# EAGLE schematic board (EAGLE 9.6.1)

## Sheet 1 of 3: key
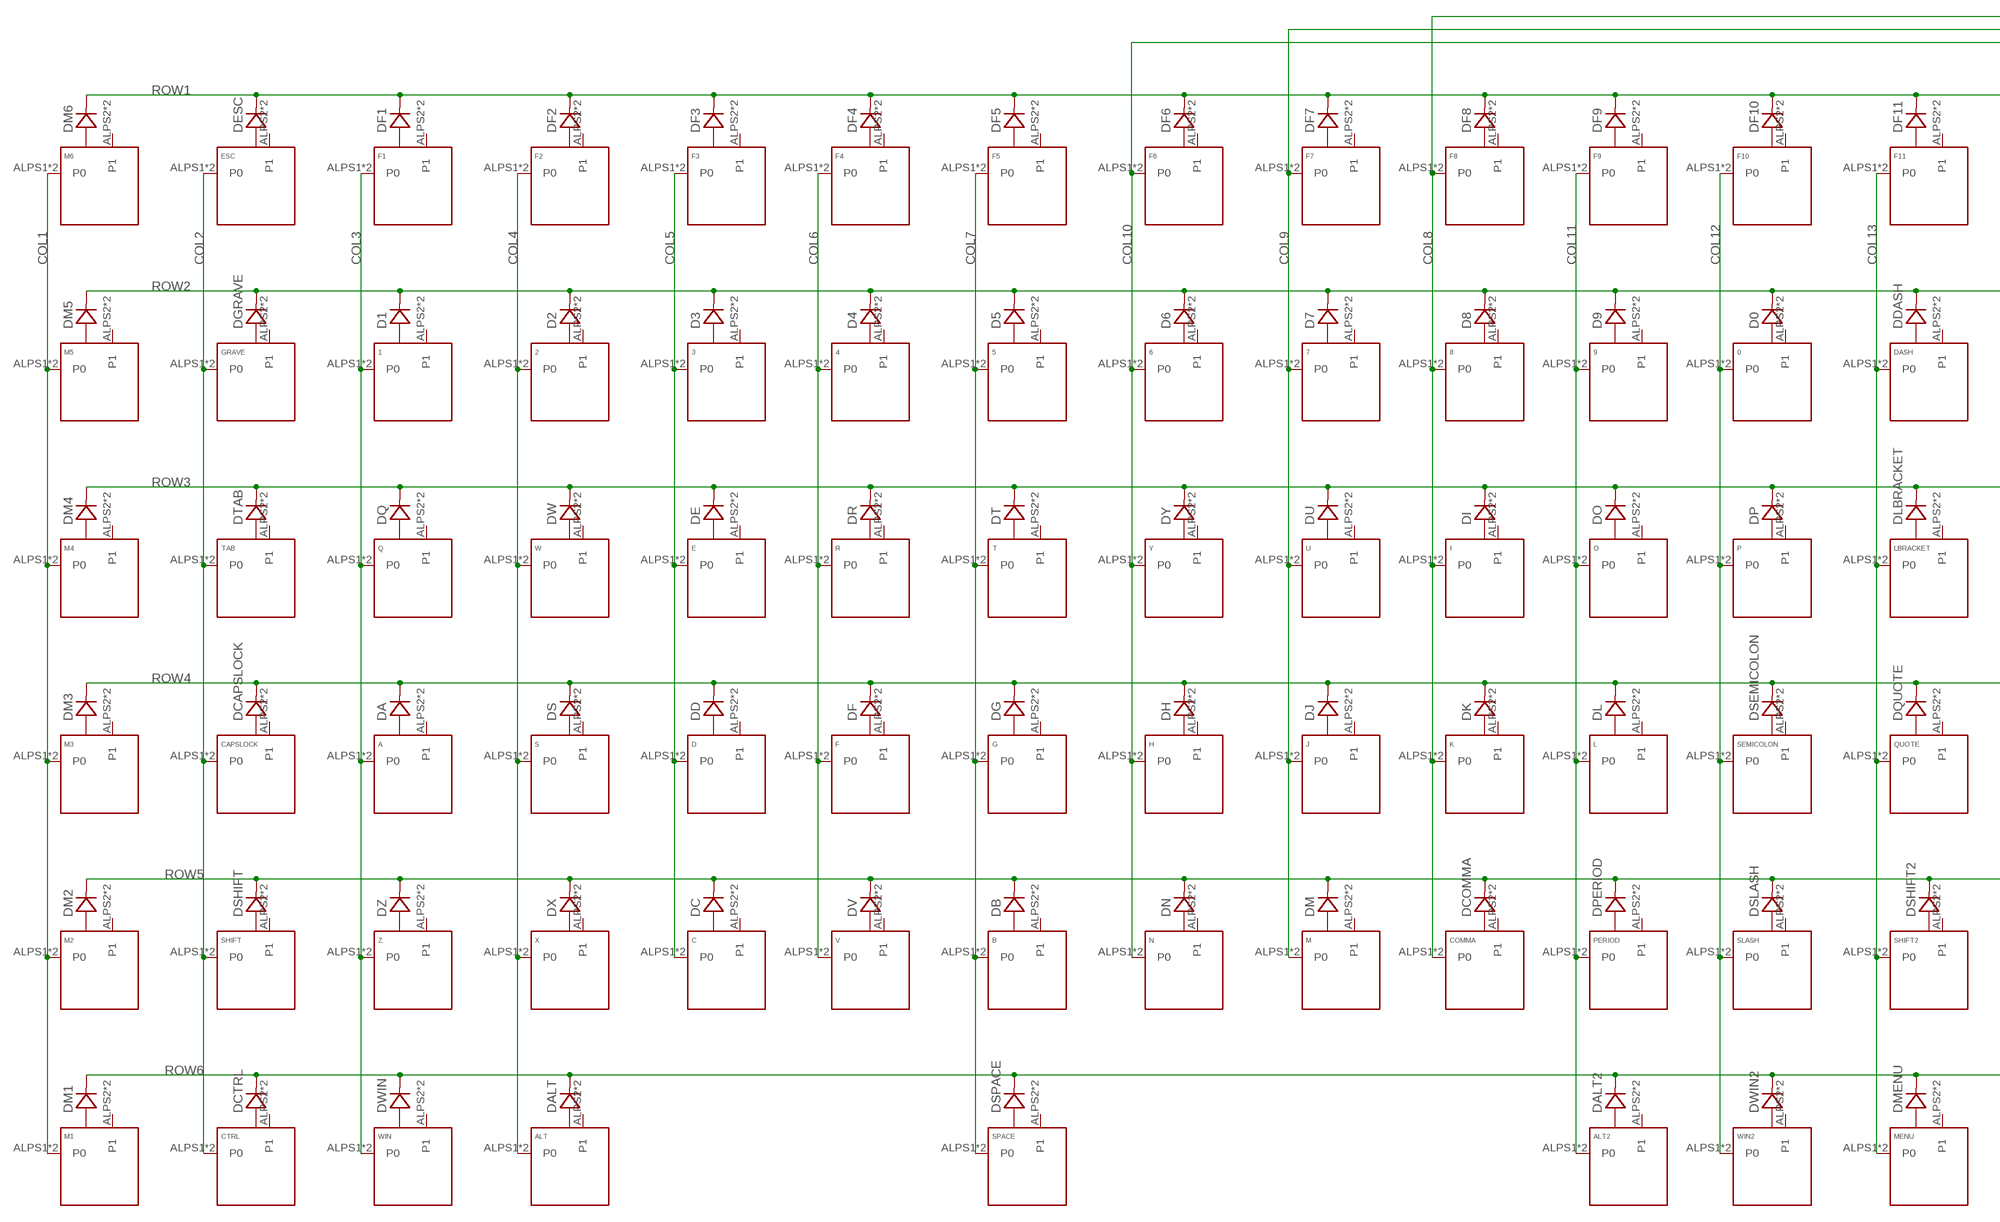
[diagram p0: schematic, sheet 1, part 1 of 2]
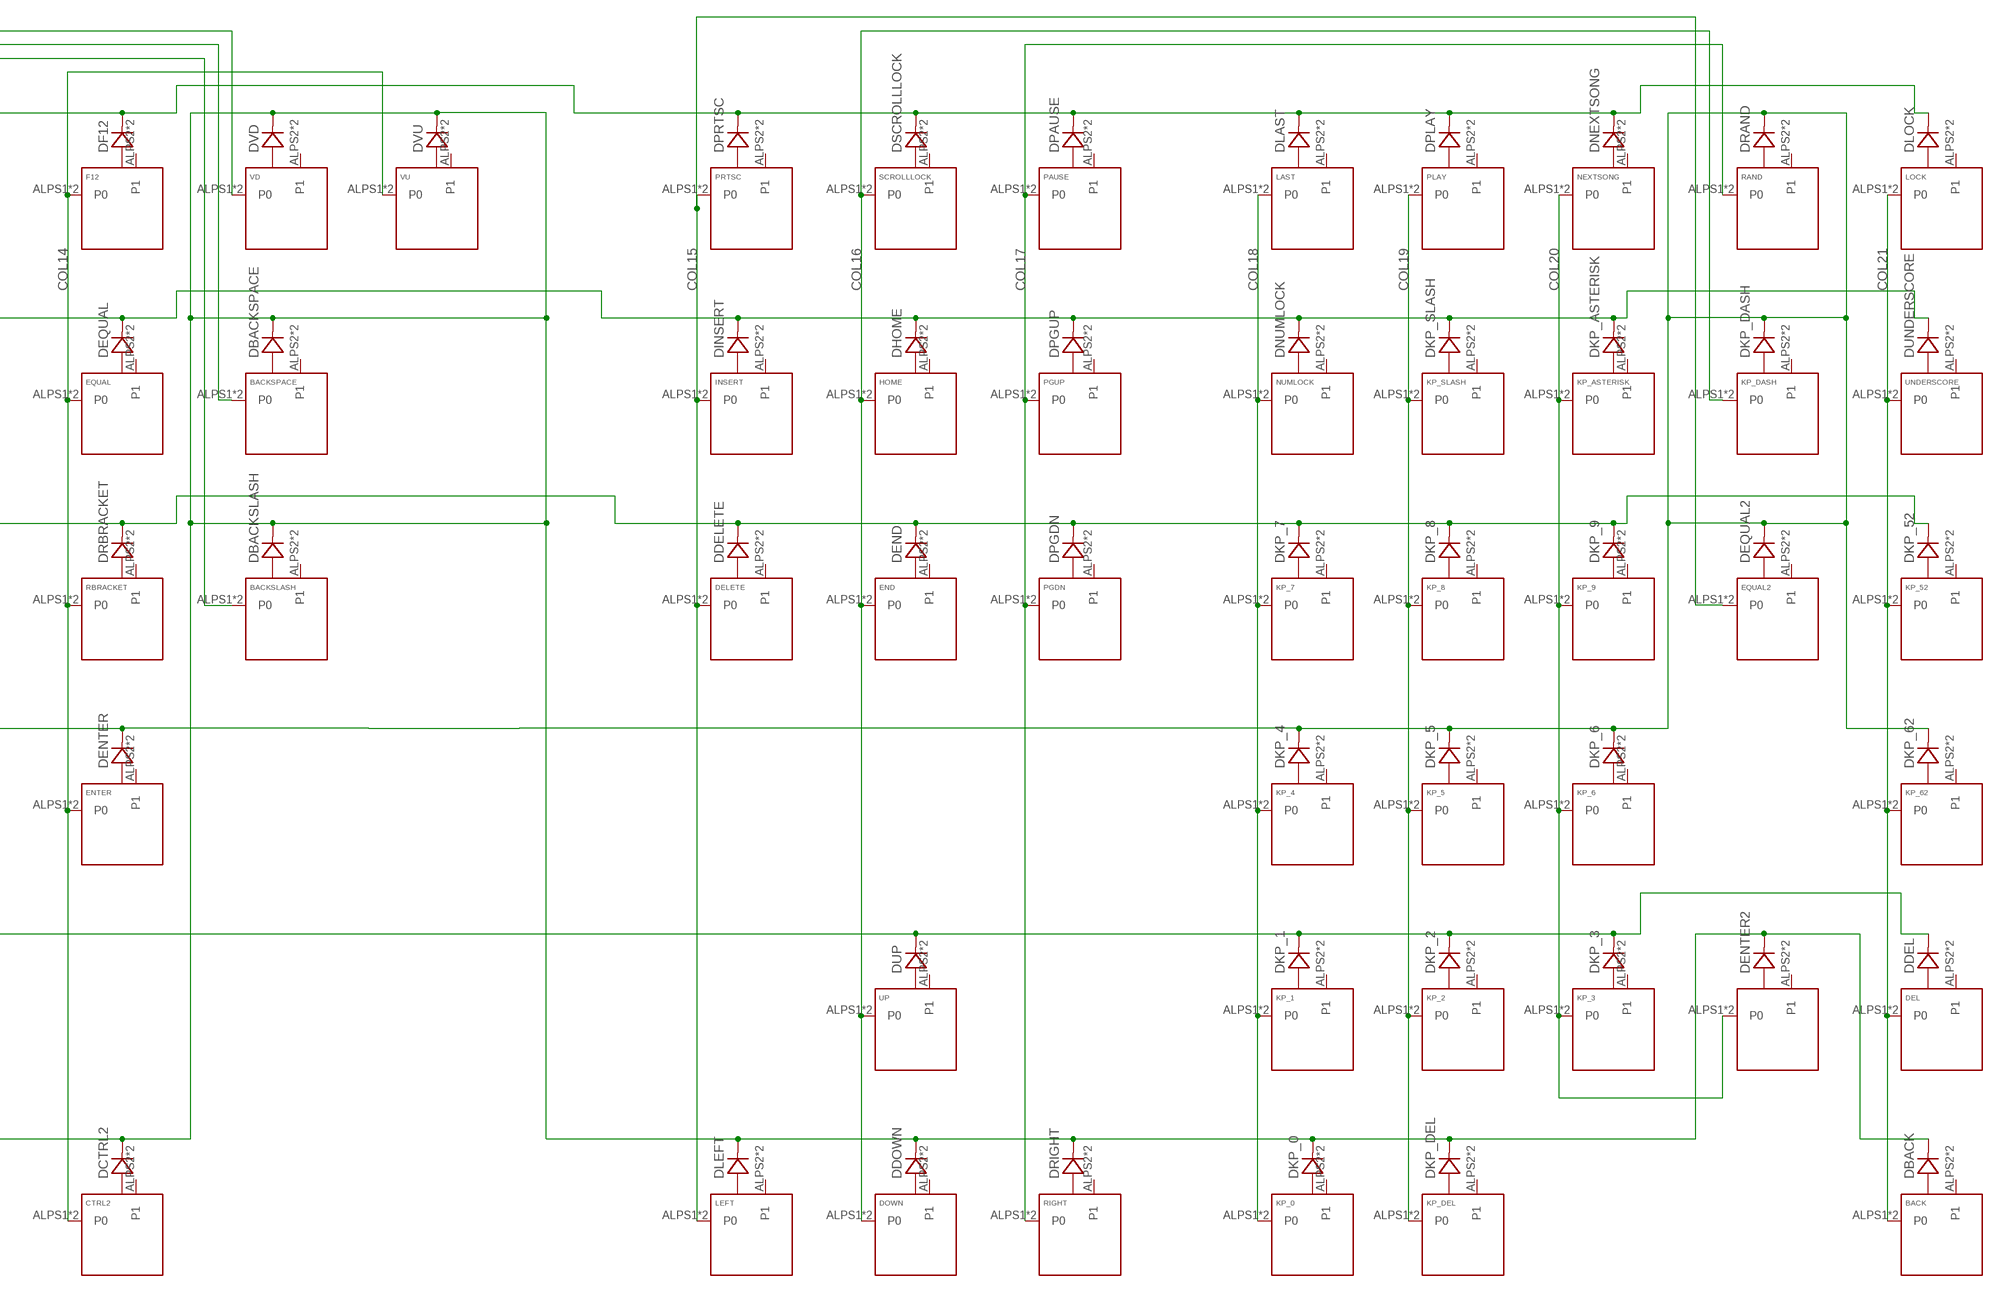
[diagram p1: schematic, sheet 1, part 2 of 2]

### Parts
0  KEYSWITCH-PLAIN-ALPSMX-1U  [ALPSMX-1U]
1  KEYSWITCH-PLAIN-ALPSMX-1U  [ALPSMX-1U]
2  KEYSWITCH-PLAIN-ALPSMX-1U  [ALPSMX-1U]
3  KEYSWITCH-PLAIN-ALPSMX-1U  [ALPSMX-1U]
4  KEYSWITCH-PLAIN-ALPSMX-1U  [ALPSMX-1U]
5  KEYSWITCH-PLAIN-ALPSMX-1U  [ALPSMX-1U]
6  KEYSWITCH-PLAIN-ALPSMX-1U  [ALPSMX-1U]
7  KEYSWITCH-PLAIN-ALPSMX-1U  [ALPSMX-1U]
8  KEYSWITCH-PLAIN-ALPSMX-1U  [ALPSMX-1U]
9  KEYSWITCH-PLAIN-ALPSMX-1U  [ALPSMX-1U]
A  KEYSWITCH-PLAIN-ALPSMX-1U  [ALPSMX-1U]
ALT  KEYSWITCH-PLAIN-ALPSMX-1U  [ALPSMX-1U]
ALT2  KEYSWITCH-PLAIN-ALPSMX-1U  [ALPSMX-1U]
B  KEYSWITCH-PLAIN-ALPSMX-1U  [ALPSMX-1U]
BACK  KEYSWITCH-PLAIN-ALPSMX-1U  [ALPSMX-1U]
BACKSLASH  KEYSWITCH-PLAIN-ALPSMX-1U  [ALPSMX-1U]
BACKSPACE  KEYSWITCH-PLAIN-ALPSMX-2U  [ALPSMX-2U]
C  KEYSWITCH-PLAIN-ALPSMX-1U  [ALPSMX-1U]
CAPSLOCK  KEYSWITCH-PLAIN-ALPSMX-1U  [ALPSMX-1U]
COMMA  KEYSWITCH-PLAIN-ALPSMX-1U  [ALPSMX-1U]
CTRL  KEYSWITCH-PLAIN-ALPSMX-1U  [ALPSMX-1U]
CTRL2  KEYSWITCH-PLAIN-ALPSMX-1U  [ALPSMX-1U]
D  KEYSWITCH-PLAIN-ALPSMX-1U  [ALPSMX-1U]
D0  DIODE-SOD-123  [SOD-123]
D1  DIODE-SOD-123  [SOD-123]
D2  DIODE-SOD-123  [SOD-123]
D3  DIODE-SOD-123  [SOD-123]
D4  DIODE-SOD-123  [SOD-123]
D5  DIODE-SOD-123  [SOD-123]
D6  DIODE-SOD-123  [SOD-123]
D7  DIODE-SOD-123  [SOD-123]
D8  DIODE-SOD-123  [SOD-123]
D9  DIODE-SOD-123  [SOD-123]
DA  DIODE-SOD-123  [SOD-123]
DALT  DIODE-SOD-123  [SOD-123]
DALT2  DIODE-SOD-123  [SOD-123]
DASH  KEYSWITCH-PLAIN-ALPSMX-1U  [ALPSMX-1U]
DB  DIODE-SOD-123  [SOD-123]
DBACK  DIODE-SOD-123  [SOD-123]
DBACKSLASH  DIODE-SOD-123  [SOD-123]
DBACKSPACE  DIODE-SOD-123  [SOD-123]
DC  DIODE-SOD-123  [SOD-123]
DCAPSLOCK  DIODE-SOD-123  [SOD-123]
DCOMMA  DIODE-SOD-123  [SOD-123]
DCTRL  DIODE-SOD-123  [SOD-123]
DCTRL2  DIODE-SOD-123  [SOD-123]
DD  DIODE-SOD-123  [SOD-123]
DDASH  DIODE-SOD-123  [SOD-123]
DDEL  DIODE-SOD-123  [SOD-123]
DDELETE  DIODE-SOD-123  [SOD-123]
DDOWN  DIODE-SOD-123  [SOD-123]
DE  DIODE-SOD-123  [SOD-123]
DEL  KEYSWITCH-PLAIN-ALPSMX-1U  [ALPSMX-1U]
DELETE  KEYSWITCH-PLAIN-ALPSMX-1U  [ALPSMX-1U]
DEND  DIODE-SOD-123  [SOD-123]
DENTER  DIODE-SOD-123  [SOD-123]
DENTER2  DIODE-SOD-123  [SOD-123]
DEQUAL  DIODE-SOD-123  [SOD-123]
DEQUAL2  DIODE-SOD-123  [SOD-123]
DESC  DIODE-SOD-123  [SOD-123]
DF  DIODE-SOD-123  [SOD-123]
DF1  DIODE-SOD-123  [SOD-123]
DF2  DIODE-SOD-123  [SOD-123]
DF3  DIODE-SOD-123  [SOD-123]
DF4  DIODE-SOD-123  [SOD-123]
DF5  DIODE-SOD-123  [SOD-123]
DF6  DIODE-SOD-123  [SOD-123]
DF7  DIODE-SOD-123  [SOD-123]
DF8  DIODE-SOD-123  [SOD-123]
DF9  DIODE-SOD-123  [SOD-123]
DF10  DIODE-SOD-123  [SOD-123]
DF11  DIODE-SOD-123  [SOD-123]
DF12  DIODE-SOD-123  [SOD-123]
DG  DIODE-SOD-123  [SOD-123]
DGRAVE  DIODE-SOD-123  [SOD-123]
DH  DIODE-SOD-123  [SOD-123]
DHOME  DIODE-SOD-123  [SOD-123]
DI  DIODE-SOD-123  [SOD-123]
DINSERT  DIODE-SOD-123  [SOD-123]
DJ  DIODE-SOD-123  [SOD-123]
DK  DIODE-SOD-123  [SOD-123]
DKP_0  DIODE-SOD-123  [SOD-123]
DKP_1  DIODE-SOD-123  [SOD-123]
DKP_2  DIODE-SOD-123  [SOD-123]
DKP_3  DIODE-SOD-123  [SOD-123]
DKP_4  DIODE-SOD-123  [SOD-123]
DKP_5  DIODE-SOD-123  [SOD-123]
DKP_6  DIODE-SOD-123  [SOD-123]
DKP_7  DIODE-SOD-123  [SOD-123]
DKP_8  DIODE-SOD-123  [SOD-123]
DKP_9  DIODE-SOD-123  [SOD-123]
DKP_52  DIODE-SOD-123  [SOD-123]
DKP_62  DIODE-SOD-123  [SOD-123]
DKP_ASTERISK  DIODE-SOD-123  [SOD-123]
DKP_DASH  DIODE-SOD-123  [SOD-123]
DKP_DEL  DIODE-SOD-123  [SOD-123]
DKP_SLASH  DIODE-SOD-123  [SOD-123]
DL  DIODE-SOD-123  [SOD-123]
DLAST  DIODE-SOD-123  [SOD-123]
DLBRACKET  DIODE-SOD-123  [SOD-123]
DLEFT  DIODE-SOD-123  [SOD-123]
DLOCK  DIODE-SOD-123  [SOD-123]
DM  DIODE-SOD-123  [SOD-123]
DM1  DIODE-SOD-123  [SOD-123]
DM2  DIODE-SOD-123  [SOD-123]
DM3  DIODE-SOD-123  [SOD-123]
DM4  DIODE-SOD-123  [SOD-123]
DM5  DIODE-SOD-123  [SOD-123]
DM6  DIODE-SOD-123  [SOD-123]
DMENU  DIODE-SOD-123  [SOD-123]
DN  DIODE-SOD-123  [SOD-123]
DNEXTSONG  DIODE-SOD-123  [SOD-123]
DNUMLOCK  DIODE-SOD-123  [SOD-123]
DO  DIODE-SOD-123  [SOD-123]
DOWN  KEYSWITCH-PLAIN-ALPSMX-1U  [ALPSMX-1U]
DP  DIODE-SOD-123  [SOD-123]
DPAUSE  DIODE-SOD-123  [SOD-123]
DPERIOD  DIODE-SOD-123  [SOD-123]
DPGDN  DIODE-SOD-123  [SOD-123]
DPGUP  DIODE-SOD-123  [SOD-123]
DPLAY  DIODE-SOD-123  [SOD-123]
DPRTSC  DIODE-SOD-123  [SOD-123]
DQ  DIODE-SOD-123  [SOD-123]
DQUOTE  DIODE-SOD-123  [SOD-123]
DR  DIODE-SOD-123  [SOD-123]
DRAND  DIODE-SOD-123  [SOD-123]
DRBRACKET  DIODE-SOD-123  [SOD-123]
DRIGHT  DIODE-SOD-123  [SOD-123]
DS  DIODE-SOD-123  [SOD-123]
DSCROLLLOCK  DIODE-SOD-123  [SOD-123]
DSEMICOLON  DIODE-SOD-123  [SOD-123]
DSHIFT  DIODE-SOD-123  [SOD-123]
DSHIFT2  DIODE-SOD-123  [SOD-123]
DSLASH  DIODE-SOD-123  [SOD-123]
DSPACE  DIODE-SOD-123  [SOD-123]
DT  DIODE-SOD-123  [SOD-123]
DTAB  DIODE-SOD-123  [SOD-123]
DU  DIODE-SOD-123  [SOD-123]
DUNDERSCORE  DIODE-SOD-123  [SOD-123]
DUP  DIODE-SOD-123  [SOD-123]
DV  DIODE-SOD-123  [SOD-123]
DVD  DIODE-SOD-123  [SOD-123]
DVU  DIODE-SOD-123  [SOD-123]
DW  DIODE-SOD-123  [SOD-123]
DWIN  DIODE-SOD-123  [SOD-123]
DWIN2  DIODE-SOD-123  [SOD-123]
DX  DIODE-SOD-123  [SOD-123]
DY  DIODE-SOD-123  [SOD-123]
DZ  DIODE-SOD-123  [SOD-123]
E  KEYSWITCH-PLAIN-ALPSMX-1U  [ALPSMX-1U]
END  KEYSWITCH-PLAIN-ALPSMX-1U  [ALPSMX-1U]
ENTER  KEYSWITCH-PLAIN-ALPSMX-2U  [ALPSMX-2U]
ENTER2  KEYSWITCH-PLAIN-ALPSMX-1U  [ALPSMX-1U]
EQUAL  KEYSWITCH-PLAIN-ALPSMX-1U  [ALPSMX-1U]
EQUAL2  KEYSWITCH-PLAIN-ALPSMX-1U  [ALPSMX-1U]
ESC  KEYSWITCH-PLAIN-ALPSMX-1U  [ALPSMX-1U]
F  KEYSWITCH-PLAIN-ALPSMX-1U  [ALPSMX-1U]
F1  KEYSWITCH-PLAIN-ALPSMX-1U  [ALPSMX-1U]
F2  KEYSWITCH-PLAIN-ALPSMX-1U  [ALPSMX-1U]
F3  KEYSWITCH-PLAIN-ALPSMX-1U  [ALPSMX-1U]
F4  KEYSWITCH-PLAIN-ALPSMX-1U  [ALPSMX-1U]
F5  KEYSWITCH-PLAIN-ALPSMX-1U  [ALPSMX-1U]
F6  KEYSWITCH-PLAIN-ALPSMX-1U  [ALPSMX-1U]
F7  KEYSWITCH-PLAIN-ALPSMX-1U  [ALPSMX-1U]
F8  KEYSWITCH-PLAIN-ALPSMX-1U  [ALPSMX-1U]
F9  KEYSWITCH-PLAIN-ALPSMX-1U  [ALPSMX-1U]
F10  KEYSWITCH-PLAIN-ALPSMX-1U  [ALPSMX-1U]
F11  KEYSWITCH-PLAIN-ALPSMX-1U  [ALPSMX-1U]
F12  KEYSWITCH-PLAIN-ALPSMX-1U  [ALPSMX-1U]
G  KEYSWITCH-PLAIN-ALPSMX-1U  [ALPSMX-1U]
GRAVE  KEYSWITCH-PLAIN-ALPSMX-1U  [ALPSMX-1U]
H  KEYSWITCH-PLAIN-ALPSMX-1U  [ALPSMX-1U]
HOME  KEYSWITCH-PLAIN-ALPSMX-1U  [ALPSMX-1U]
I  KEYSWITCH-PLAIN-ALPSMX-1U  [ALPSMX-1U]
INSERT  KEYSWITCH-PLAIN-ALPSMX-1U  [ALPSMX-1U]
J  KEYSWITCH-PLAIN-ALPSMX-1U  [ALPSMX-1U]
K  KEYSWITCH-PLAIN-ALPSMX-1U  [ALPSMX-1U]
KP_0  KEYSWITCH-PLAIN-ALPSMX-2U  [ALPSMX-2U]
KP_1  KEYSWITCH-PLAIN-ALPSMX-1U  [ALPSMX-1U]
KP_2  KEYSWITCH-PLAIN-ALPSMX-1U  [ALPSMX-1U]
KP_3  KEYSWITCH-PLAIN-ALPSMX-1U  [ALPSMX-1U]
KP_4  KEYSWITCH-PLAIN-ALPSMX-1U  [ALPSMX-1U]
KP_5  KEYSWITCH-PLAIN-ALPSMX-1U  [ALPSMX-1U]
KP_6  KEYSWITCH-PLAIN-ALPSMX-1U  [ALPSMX-1U]
KP_7  KEYSWITCH-PLAIN-ALPSMX-1U  [ALPSMX-1U]
KP_8  KEYSWITCH-PLAIN-ALPSMX-1U  [ALPSMX-1U]
KP_9  KEYSWITCH-PLAIN-ALPSMX-1U  [ALPSMX-1U]
KP_52  KEYSWITCH-PLAIN-ALPSMX-1U  [ALPSMX-1U]
KP_62  KEYSWITCH-PLAIN-ALPSMX-1U  [ALPSMX-1U]
KP_ASTERISK  KEYSWITCH-PLAIN-ALPSMX-1U  [ALPSMX-1U]
KP_DASH  KEYSWITCH-PLAIN-ALPSMX-1U  [ALPSMX-1U]
KP_DEL  KEYSWITCH-PLAIN-ALPSMX-1U  [ALPSMX-1U]
KP_SLASH  KEYSWITCH-PLAIN-ALPSMX-1U  [ALPSMX-1U]
L  KEYSWITCH-PLAIN-ALPSMX-1U  [ALPSMX-1U]
LAST  KEYSWITCH-PLAIN-ALPSMX-1U  [ALPSMX-1U]
LBRACKET  KEYSWITCH-PLAIN-ALPSMX-1U  [ALPSMX-1U]
LEFT  KEYSWITCH-PLAIN-ALPSMX-1U  [ALPSMX-1U]
LOCK  KEYSWITCH-PLAIN-ALPSMX-1U  [ALPSMX-1U]
M  KEYSWITCH-PLAIN-ALPSMX-1U  [ALPSMX-1U]
M1  KEYSWITCH-PLAIN-ALPSMX-1U  [ALPSMX-1U]
M2  KEYSWITCH-PLAIN-ALPSMX-1U  [ALPSMX-1U]
M3  KEYSWITCH-PLAIN-ALPSMX-1U  [ALPSMX-1U]
M4  KEYSWITCH-PLAIN-ALPSMX-1U  [ALPSMX-1U]
M5  KEYSWITCH-PLAIN-ALPSMX-1U  [ALPSMX-1U]
M6  KEYSWITCH-PLAIN-ALPSMX-1U  [ALPSMX-1U]
MENU  KEYSWITCH-PLAIN-ALPSMX-1U  [ALPSMX-1U]
N  KEYSWITCH-PLAIN-ALPSMX-1U  [ALPSMX-1U]
NEXTSONG  KEYSWITCH-PLAIN-ALPSMX-1U  [ALPSMX-1U]
NUMLOCK  KEYSWITCH-PLAIN-ALPSMX-1U  [ALPSMX-1U]
O  KEYSWITCH-PLAIN-ALPSMX-1U  [ALPSMX-1U]
P  KEYSWITCH-PLAIN-ALPSMX-1U  [ALPSMX-1U]
PAUSE  KEYSWITCH-PLAIN-ALPSMX-1U  [ALPSMX-1U]
PERIOD  KEYSWITCH-PLAIN-ALPSMX-1U  [ALPSMX-1U]
PGDN  KEYSWITCH-PLAIN-ALPSMX-1U  [ALPSMX-1U]
PGUP  KEYSWITCH-PLAIN-ALPSMX-1U  [ALPSMX-1U]
PLAY  KEYSWITCH-PLAIN-ALPSMX-1U  [ALPSMX-1U]
PRTSC  KEYSWITCH-PLAIN-ALPSMX-1U  [ALPSMX-1U]
Q  KEYSWITCH-PLAIN-ALPSMX-1U  [ALPSMX-1U]
QUOTE  KEYSWITCH-PLAIN-ALPSMX-1U  [ALPSMX-1U]
R  KEYSWITCH-PLAIN-ALPSMX-1U  [ALPSMX-1U]
RAND  KEYSWITCH-PLAIN-ALPSMX-1U  [ALPSMX-1U]
RBRACKET  KEYSWITCH-PLAIN-ALPSMX-1U  [ALPSMX-1U]
RIGHT  KEYSWITCH-PLAIN-ALPSMX-1U  [ALPSMX-1U]
S  KEYSWITCH-PLAIN-ALPSMX-1U  [ALPSMX-1U]
SCROLLLOCK  KEYSWITCH-PLAIN-ALPSMX-1U  [ALPSMX-1U]
SEMICOLON  KEYSWITCH-PLAIN-ALPSMX-1U  [ALPSMX-1U]
SHIFT  KEYSWITCH-PLAIN-ALPSMX-2U  [ALPSMX-2U]
SHIFT2  KEYSWITCH-PLAIN-ALPSMX-2U  [ALPSMX-2U]
SLASH  KEYSWITCH-PLAIN-ALPSMX-1U  [ALPSMX-1U]
SPACE  KEYSWITCH-PLAIN-ALPSMX-6.25U  [ALPSMX-6.25U]
T  KEYSWITCH-PLAIN-ALPSMX-1U  [ALPSMX-1U]
TAB  KEYSWITCH-PLAIN-ALPSMX-1U  [ALPSMX-1U]
U  KEYSWITCH-PLAIN-ALPSMX-1U  [ALPSMX-1U]
UNDERSCORE  KEYSWITCH-PLAIN-ALPSMX-1U  [ALPSMX-1U]
UP  KEYSWITCH-PLAIN-ALPSMX-1U  [ALPSMX-1U]
V  KEYSWITCH-PLAIN-ALPSMX-1U  [ALPSMX-1U]
VD  KEYSWITCH-PLAIN-ALPSMX-1U  [ALPSMX-1U]
VU  KEYSWITCH-PLAIN-ALPSMX-1U  [ALPSMX-1U]
W  KEYSWITCH-PLAIN-ALPSMX-1U  [ALPSMX-1U]
WIN  KEYSWITCH-PLAIN-ALPSMX-1U  [ALPSMX-1U]
WIN2  KEYSWITCH-PLAIN-ALPSMX-1U  [ALPSMX-1U]
X  KEYSWITCH-PLAIN-ALPSMX-1U  [ALPSMX-1U]
Y  KEYSWITCH-PLAIN-ALPSMX-1U  [ALPSMX-1U]
Z  KEYSWITCH-PLAIN-ALPSMX-1U  [ALPSMX-1U]

### Nets
COL1: M1.ALPS1(P0) M1.MX1(P0) M2.ALPS1(P0) M2.MX1(P0) M3.ALPS1(P0) M3.MX1(P0) M4.ALPS1(P0) M4.MX1(P0) M5.ALPS1(P0) M5.MX1(P0) M6.ALPS1(P0) M6.MX1(P0) ; also sheet 3
COL2: CAPSLOCK.ALPS1(P0) CAPSLOCK.MX1(P0) CTRL.ALPS1(P0) CTRL.MX1(P0) ESC.ALPS1(P0) ESC.MX1(P0) GRAVE.ALPS1(P0) GRAVE.MX1(P0) SHIFT.ALPS1(P0) SHIFT.MX1(P0) TAB.ALPS1(P0) TAB.MX1(P0) ; also sheet 3
COL3: 1.ALPS1(P0) 1.MX1(P0) A.ALPS1(P0) A.MX1(P0) F1.ALPS1(P0) F1.MX1(P0) Q.ALPS1(P0) Q.MX1(P0) WIN.ALPS1(P0) WIN.MX1(P0) Z.ALPS1(P0) Z.MX1(P0) ; also sheet 3
COL4: 2.ALPS1(P0) 2.MX1(P0) ALT.ALPS1(P0) ALT.MX1(P0) F2.ALPS1(P0) F2.MX1(P0) S.ALPS1(P0) S.MX1(P0) W.ALPS1(P0) W.MX1(P0) X.ALPS1(P0) X.MX1(P0) ; also sheet 3
COL5: 3.ALPS1(P0) 3.MX1(P0) C.ALPS1(P0) C.MX1(P0) D.ALPS1(P0) D.MX1(P0) E.ALPS1(P0) E.MX1(P0) F3.ALPS1(P0) F3.MX1(P0) ; also sheet 3
COL6: 4.ALPS1(P0) 4.MX1(P0) F4.ALPS1(P0) F4.MX1(P0) F.ALPS1(P0) F.MX1(P0) R.ALPS1(P0) R.MX1(P0) V.ALPS1(P0) V.MX1(P0) ; also sheet 3
COL7: 5.ALPS1(P0) 5.MX1(P0) B.ALPS1(P0) B.MX1(P0) F5.ALPS1(P0) F5.MX1(P0) G.ALPS1(P0) G.MX1(P0) SPACE.ALPS1(P0) SPACE.MX1(P0) T.ALPS1(P0) T.MX1(P0) ; also sheet 3
COL8: 8.ALPS1(P0) 8.MX1(P0) COMMA.ALPS1(P0) COMMA.MX1(P0) F8.ALPS1(P0) F8.MX1(P0) I.ALPS1(P0) I.MX1(P0) K.ALPS1(P0) K.MX1(P0) VD.ALPS1(P0) VD.MX1(P0) ; also sheet 3
COL9: 7.ALPS1(P0) 7.MX1(P0) BACKSPACE.ALPS1(P0) BACKSPACE.MX1(P0) F7.ALPS1(P0) F7.MX1(P0) J.ALPS1(P0) J.MX1(P0) M.ALPS1(P0) M.MX1(P0) U.ALPS1(P0) U.MX1(P0) ; also sheet 3
COL10: 6.ALPS1(P0) 6.MX1(P0) BACKSLASH.ALPS1(P0) BACKSLASH.MX1(P0) F6.ALPS1(P0) F6.MX1(P0) H.ALPS1(P0) H.MX1(P0) N.ALPS1(P0) N.MX1(P0) Y.ALPS1(P0) Y.MX1(P0) ; also sheet 3
COL11: 9.ALPS1(P0) 9.MX1(P0) ALT2.ALPS1(P0) ALT2.MX1(P0) F9.ALPS1(P0) F9.MX1(P0) L.ALPS1(P0) L.MX1(P0) O.ALPS1(P0) O.MX1(P0) PERIOD.ALPS1(P0) PERIOD.MX1(P0) ; also sheet 3
COL12: 0.ALPS1(P0) 0.MX1(P0) F10.ALPS1(P0) F10.MX1(P0) P.ALPS1(P0) P.MX1(P0) SEMICOLON.ALPS1(P0) SEMICOLON.MX1(P0) SLASH.ALPS1(P0) SLASH.MX1(P0) WIN2.ALPS1(P0) WIN2.MX1(P0) ; also sheet 3
COL13: DASH.ALPS1(P0) DASH.MX1(P0) F11.ALPS1(P0) F11.MX1(P0) LBRACKET.ALPS1(P0) LBRACKET.MX1(P0) MENU.ALPS1(P0) MENU.MX1(P0) QUOTE.ALPS1(P0) QUOTE.MX1(P0) SHIFT2.ALPS1(P0) SHIFT2.MX1(P0) ; also sheet 3
COL14: CTRL2.ALPS1(P0) CTRL2.MX1(P0) ENTER.ALPS1(P0) ENTER.MX1(P0) EQUAL.ALPS1(P0) EQUAL.MX1(P0) F12.ALPS1(P0) F12.MX1(P0) RBRACKET.ALPS1(P0) RBRACKET.MX1(P0) VU.ALPS1(P0) VU.MX1(P0) ; also sheet 3
COL15: DELETE.ALPS1(P0) DELETE.MX1(P0) EQUAL2.ALPS1(P0) EQUAL2.MX1(P0) INSERT.ALPS1(P0) INSERT.MX1(P0) LEFT.ALPS1(P0) LEFT.MX1(P0) PRTSC.ALPS1(P0) PRTSC.MX1(P0) ; also sheet 3
COL16: DOWN.ALPS1(P0) DOWN.MX1(P0) END.ALPS1(P0) END.MX1(P0) HOME.ALPS1(P0) HOME.MX1(P0) KP_DASH.ALPS1(P0) KP_DASH.MX1(P0) SCROLLLOCK.ALPS1(P0) SCROLLLOCK.MX1(P0) UP.ALPS1(P0) UP.MX1(P0) ; also sheet 3
COL17: PAUSE.ALPS1(P0) PAUSE.MX1(P0) PGDN.ALPS1(P0) PGDN.MX1(P0) PGUP.ALPS1(P0) PGUP.MX1(P0) RAND.ALPS1(P0) RAND.MX1(P0) RIGHT.ALPS1(P0) RIGHT.MX1(P0) ; also sheet 3
COL18: KP_0.ALPS1(P0) KP_0.MX1(P0) KP_1.ALPS1(P0) KP_1.MX1(P0) KP_4.ALPS1(P0) KP_4.MX1(P0) KP_7.ALPS1(P0) KP_7.MX1(P0) LAST.ALPS1(P0) LAST.MX1(P0) NUMLOCK.ALPS1(P0) NUMLOCK.MX1(P0) ; also sheet 3
COL19: KP_2.ALPS1(P0) KP_2.MX1(P0) KP_5.ALPS1(P0) KP_5.MX1(P0) KP_8.ALPS1(P0) KP_8.MX1(P0) KP_DEL.ALPS1(P0) KP_DEL.MX1(P0) KP_SLASH.ALPS1(P0) KP_SLASH.MX1(P0) PLAY.ALPS1(P0) PLAY.MX1(P0) ; also sheet 3
COL20: ENTER2.ALPS1(P0) ENTER2.MX1(P0) KP_3.ALPS1(P0) KP_3.MX1(P0) KP_6.ALPS1(P0) KP_6.MX1(P0) KP_9.ALPS1(P0) KP_9.MX1(P0) KP_ASTERISK.ALPS1(P0) KP_ASTERISK.MX1(P0) NEXTSONG.ALPS1(P0) NEXTSONG.MX1(P0) ; also sheet 3
COL21: BACK.ALPS1(P0) BACK.MX1(P0) DEL.ALPS1(P0) DEL.MX1(P0) KP_52.ALPS1(P0) KP_52.MX1(P0) KP_62.ALPS1(P0) KP_62.MX1(P0) LOCK.ALPS1(P0) LOCK.MX1(P0) UNDERSCORE.ALPS1(P0) UNDERSCORE.MX1(P0) ; also sheet 3
ROW1: DESC.C DF1.C DF2.C DF3.C DF4.C DF5.C DF6.C DF7.C DF8.C DF9.C DF10.C DF11.C DF12.C DLAST.C DLOCK.C DM6.C DNEXTSONG.C DPAUSE.C DPLAY.C DPRTSC.C DSCROLLLOCK.C ; also sheet 3
ROW2: D0.C D1.C D2.C D3.C D4.C D5.C D6.C D7.C D8.C D9.C DDASH.C DEQUAL.C DGRAVE.C DHOME.C DINSERT.C DKP_ASTERISK.C DKP_SLASH.C DM5.C DNUMLOCK.C DPGUP.C DUNDERSCORE.C ; also sheet 3
ROW3: DDELETE.C DE.C DEND.C DI.C DKP_7.C DKP_8.C DKP_9.C DKP_52.C DLBRACKET.C DM4.C DO.C DP.C DPGDN.C DQ.C DR.C DRBRACKET.C DT.C DTAB.C DU.C DW.C DY.C ; also sheet 3
ROW4: DA.C DCAPSLOCK.C DD.C DENTER.C DEQUAL2.C DF.C DG.C DH.C DJ.C DK.C DKP_4.C DKP_5.C DKP_6.C DKP_62.C DKP_DASH.C DL.C DM3.C DQUOTE.C DRAND.C DS.C DSEMICOLON.C ; also sheet 3
ROW5: DB.C DC.C DCOMMA.C DDEL.C DKP_1.C DKP_2.C DKP_3.C DM2.C DM.C DN.C DPERIOD.C DSHIFT2.C DSHIFT.C DSLASH.C DUP.C DV.C DX.C DZ.C ; also sheet 3
ROW6: DALT2.C DALT.C DBACK.C DBACKSLASH.C DBACKSPACE.C DCTRL2.C DCTRL.C DDOWN.C DENTER2.C DKP_0.C DKP_DEL.C DLEFT.C DM1.C DMENU.C DRIGHT.C DSPACE.C DVD.C DVU.C DWIN2.C DWIN.C ; also sheet 3
Unconnected: 0.ALPS2(P1) 0.MX2(P1) 1.ALPS2(P1) 1.MX2(P1) 2.ALPS2(P1) 2.MX2(P1) 3.ALPS2(P1) 3.MX2(P1) 4.ALPS2(P1) 4.MX2(P1) 5.ALPS2(P1) 5.MX2(P1) 6.ALPS2(P1) 6.MX2(P1) 7.ALPS2(P1) 7.MX2(P1) 8.ALPS2(P1) 8.MX2(P1) 9.ALPS2(P1) 9.MX2(P1) A.ALPS2(P1) A.MX2(P1) ALT2.ALPS2(P1) ALT2.MX2(P1) ALT.ALPS2(P1) ALT.MX2(P1) B.ALPS2(P1) B.MX2(P1) BACK.ALPS2(P1) BACK.MX2(P1) BACKSLASH.ALPS2(P1) BACKSLASH.MX2(P1) BACKSPACE.ALPS2(P1) BACKSPACE.MX2(P1) C.ALPS2(P1) C.MX2(P1) CAPSLOCK.ALPS2(P1) CAPSLOCK.MX2(P1) COMMA.ALPS2(P1) COMMA.MX2(P1) CTRL2.ALPS2(P1) CTRL2.MX2(P1) CTRL.ALPS2(P1) CTRL.MX2(P1) D0.A D1.A D2.A D3.A D4.A D5.A D6.A D7.A D8.A D9.A D.ALPS2(P1) D.MX2(P1) DA.A DALT2.A DALT.A DASH.ALPS2(P1) DASH.MX2(P1) DB.A DBACK.A DBACKSLASH.A DBACKSPACE.A DC.A DCAPSLOCK.A DCOMMA.A DCTRL2.A DCTRL.A DD.A DDASH.A DDEL.A DDELETE.A DDOWN.A DE.A DEL.ALPS2(P1) DEL.MX2(P1) DELETE.ALPS2(P1) DELETE.MX2(P1) DEND.A DENTER2.A DENTER.A DEQUAL2.A DEQUAL.A DESC.A DF1.A DF2.A DF3.A DF4.A DF5.A DF6.A DF7.A DF8.A DF9.A DF10.A DF11.A DF12.A DF.A DG.A DGRAVE.A DH.A DHOME.A DI.A DINSERT.A DJ.A DK.A DKP_0.A DKP_1.A DKP_2.A DKP_3.A DKP_4.A DKP_5.A DKP_6.A DKP_7.A DKP_8.A DKP_9.A DKP_52.A DKP_62.A DKP_ASTERISK.A DKP_DASH.A DKP_DEL.A DKP_SLASH.A DL.A DLAST.A DLBRACKET.A DLEFT.A DLOCK.A DM1.A DM2.A DM3.A DM4.A DM5.A DM6.A DM.A DMENU.A DN.A DNEXTSONG.A DNUMLOCK.A DO.A DOWN.ALPS2(P1) DOWN.MX2(P1) DP.A DPAUSE.A DPERIOD.A DPGDN.A DPGUP.A DPLAY.A DPRTSC.A DQ.A DQUOTE.A DR.A DRAND.A DRBRACKET.A DRIGHT.A DS.A DSCROLLLOCK.A DSEMICOLON.A DSHIFT2.A DSHIFT.A DSLASH.A DSPACE.A DT.A DTAB.A DU.A DUNDERSCORE.A DUP.A DV.A DVD.A DVU.A DW.A DWIN2.A DWIN.A DX.A DY.A DZ.A E.ALPS2(P1) E.MX2(P1) END.ALPS2(P1) END.MX2(P1) ENTER2.ALPS2(P1) ENTER2.MX2(P1) ENTER.ALPS2(P1) ENTER.MX2(P1) EQUAL2.ALPS2(P1) EQUAL2.MX2(P1) EQUAL.ALPS2(P1) EQUAL.MX2(P1) ESC.ALPS2(P1) ESC.MX2(P1) F1.ALPS2(P1) F1.MX2(P1) F2.ALPS2(P1) F2.MX2(P1) F3.ALPS2(P1) F3.MX2(P1) F4.ALPS2(P1) F4.MX2(P1) F5.ALPS2(P1) F5.MX2(P1) F6.ALPS2(P1) F6.MX2(P1) F7.ALPS2(P1) F7.MX2(P1) F8.ALPS2(P1) F8.MX2(P1) F9.ALPS2(P1) F9.MX2(P1) F10.ALPS2(P1) F10.MX2(P1) F11.ALPS2(P1) F11.MX2(P1) F12.ALPS2(P1) F12.MX2(P1) F.ALPS2(P1) F.MX2(P1) G.ALPS2(P1) G.MX2(P1) GRAVE.ALPS2(P1) GRAVE.MX2(P1) H.ALPS2(P1) H.MX2(P1) HOME.ALPS2(P1) HOME.MX2(P1) I.ALPS2(P1) I.MX2(P1) INSERT.ALPS2(P1) INSERT.MX2(P1) J.ALPS2(P1) J.MX2(P1) K.ALPS2(P1) K.MX2(P1) KP_0.ALPS2(P1) KP_0.MX2(P1) KP_1.ALPS2(P1) KP_1.MX2(P1) KP_2.ALPS2(P1) KP_2.MX2(P1) KP_3.ALPS2(P1) KP_3.MX2(P1) KP_4.ALPS2(P1) KP_4.MX2(P1) KP_5.ALPS2(P1) KP_5.MX2(P1) KP_6.ALPS2(P1) KP_6.MX2(P1) KP_7.ALPS2(P1) KP_7.MX2(P1) KP_8.ALPS2(P1) KP_8.MX2(P1) KP_9.ALPS2(P1) KP_9.MX2(P1) KP_52.ALPS2(P1) KP_52.MX2(P1) KP_62.ALPS2(P1) KP_62.MX2(P1) KP_ASTERISK.ALPS2(P1) KP_ASTERISK.MX2(P1) KP_DASH.ALPS2(P1) KP_DASH.MX2(P1) KP_DEL.ALPS2(P1) KP_DEL.MX2(P1) KP_SLASH.ALPS2(P1) KP_SLASH.MX2(P1) L.ALPS2(P1) L.MX2(P1) LAST.ALPS2(P1) LAST.MX2(P1) LBRACKET.ALPS2(P1) LBRACKET.MX2(P1) LEFT.ALPS2(P1) LEFT.MX2(P1) LOCK.ALPS2(P1) LOCK.MX2(P1) M1.ALPS2(P1) M1.MX2(P1) M2.ALPS2(P1) M2.MX2(P1) M3.ALPS2(P1) M3.MX2(P1) M4.ALPS2(P1) M4.MX2(P1) M5.ALPS2(P1) M5.MX2(P1) M6.ALPS2(P1) M6.MX2(P1) M.ALPS2(P1) M.MX2(P1) MENU.ALPS2(P1) MENU.MX2(P1) N.ALPS2(P1) N.MX2(P1) NEXTSONG.ALPS2(P1) NEXTSONG.MX2(P1) NUMLOCK.ALPS2(P1) NUMLOCK.MX2(P1) O.ALPS2(P1) O.MX2(P1) P.ALPS2(P1) P.MX2(P1) PAUSE.ALPS2(P1) PAUSE.MX2(P1) PERIOD.ALPS2(P1) PERIOD.MX2(P1) PGDN.ALPS2(P1) PGDN.MX2(P1) PGUP.ALPS2(P1) PGUP.MX2(P1) PLAY.ALPS2(P1) PLAY.MX2(P1) PRTSC.ALPS2(P1) PRTSC.MX2(P1) Q.ALPS2(P1) Q.MX2(P1) QUOTE.ALPS2(P1) QUOTE.MX2(P1) R.ALPS2(P1) R.MX2(P1) RAND.ALPS2(P1) RAND.MX2(P1) RBRACKET.ALPS2(P1) RBRACKET.MX2(P1) RIGHT.ALPS2(P1) RIGHT.MX2(P1) S.ALPS2(P1) S.MX2(P1) SCROLLLOCK.ALPS2(P1) SCROLLLOCK.MX2(P1) SEMICOLON.ALPS2(P1) SEMICOLON.MX2(P1) SHIFT2.ALPS2(P1) SHIFT2.MX2(P1) SHIFT.ALPS2(P1) SHIFT.MX2(P1) SLASH.ALPS2(P1) SLASH.MX2(P1) SPACE.ALPS2(P1) SPACE.MX2(P1) T.ALPS2(P1) T.MX2(P1) TAB.ALPS2(P1) TAB.MX2(P1) U.ALPS2(P1) U.MX2(P1) UNDERSCORE.ALPS2(P1) UNDERSCORE.MX2(P1) UP.ALPS2(P1) UP.MX2(P1) V.ALPS2(P1) V.MX2(P1) VD.ALPS2(P1) VD.MX2(P1) VU.ALPS2(P1) VU.MX2(P1) W.ALPS2(P1) W.MX2(P1) WIN2.ALPS2(P1) WIN2.MX2(P1) WIN.ALPS2(P1) WIN.MX2(P1) X.ALPS2(P1) X.MX2(P1) Y.ALPS2(P1) Y.MX2(P1) Z.ALPS2(P1) Z.MX2(P1)

## Sheet 2 of 3: LED
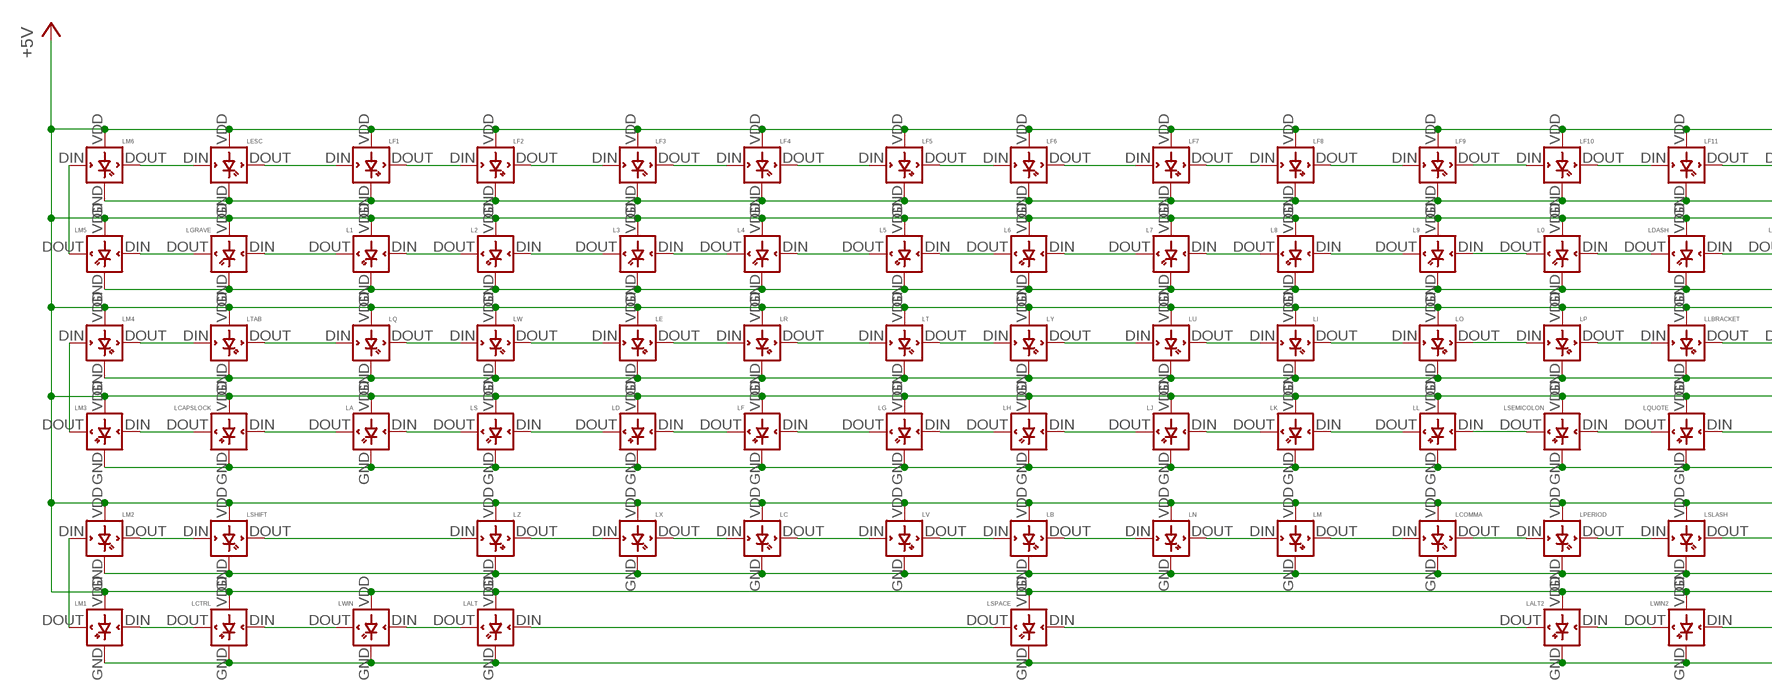
[diagram p2: schematic, sheet 2, part 1 of 2]
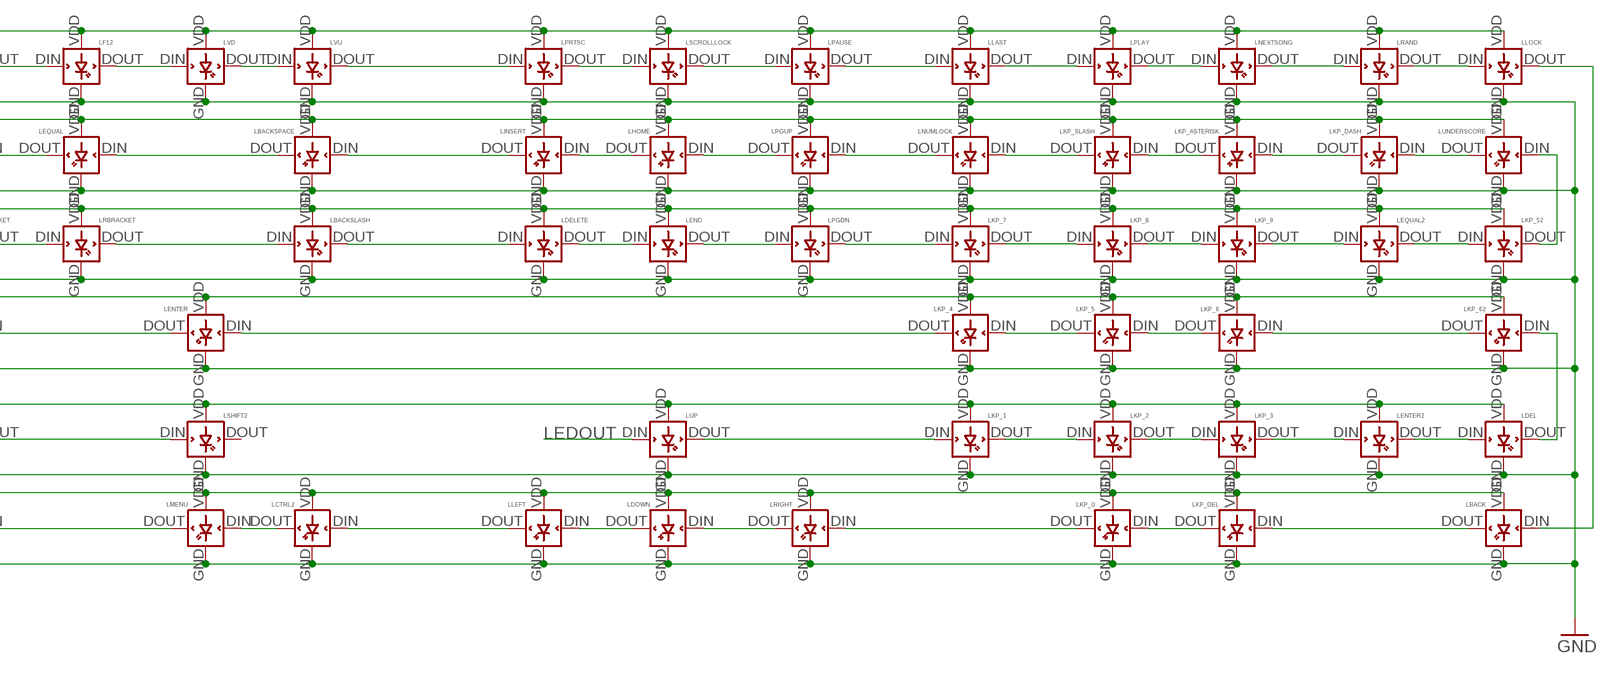
[diagram p3: schematic, sheet 2, part 2 of 2]

### Parts
L0  WS2812B-MINI  [WS2812B-MINI]
L1  WS2812B-MINI  [WS2812B-MINI]
L2  WS2812B-MINI  [WS2812B-MINI]
L3  WS2812B-MINI  [WS2812B-MINI]
L4  WS2812B-MINI  [WS2812B-MINI]
L5  WS2812B-MINI  [WS2812B-MINI]
L6  WS2812B-MINI  [WS2812B-MINI]
L7  WS2812B-MINI  [WS2812B-MINI]
L8  WS2812B-MINI  [WS2812B-MINI]
L9  WS2812B-MINI  [WS2812B-MINI]
LA  WS2812B-MINI  [WS2812B-MINI]
LALT  WS2812B-MINI  [WS2812B-MINI]
LALT2  WS2812B-MINI  [WS2812B-MINI]
LB  WS2812B-MINI  [WS2812B-MINI]
LBACK  WS2812B-MINI  [WS2812B-MINI]
LBACKSLASH  WS2812B-MINI  [WS2812B-MINI]
LBACKSPACE  WS2812B-MINI  [WS2812B-MINI]
LC  WS2812B-MINI  [WS2812B-MINI]
LCAPSLOCK  WS2812B-MINI  [WS2812B-MINI]
LCOMMA  WS2812B-MINI  [WS2812B-MINI]
LCTRL  WS2812B-MINI  [WS2812B-MINI]
LCTRL2  WS2812B-MINI  [WS2812B-MINI]
LD  WS2812B-MINI  [WS2812B-MINI]
LDASH  WS2812B-MINI  [WS2812B-MINI]
LDEL  WS2812B-MINI  [WS2812B-MINI]
LDELETE  WS2812B-MINI  [WS2812B-MINI]
LDOWN  WS2812B-MINI  [WS2812B-MINI]
LE  WS2812B-MINI  [WS2812B-MINI]
LEND  WS2812B-MINI  [WS2812B-MINI]
LENTER  WS2812B-MINI  [WS2812B-MINI]
LENTER2  WS2812B-MINI  [WS2812B-MINI]
LEQUAL  WS2812B-MINI  [WS2812B-MINI]
LEQUAL2  WS2812B-MINI  [WS2812B-MINI]
LESC  WS2812B-MINI  [WS2812B-MINI]
LF  WS2812B-MINI  [WS2812B-MINI]
LF1  WS2812B-MINI  [WS2812B-MINI]
LF2  WS2812B-MINI  [WS2812B-MINI]
LF3  WS2812B-MINI  [WS2812B-MINI]
LF4  WS2812B-MINI  [WS2812B-MINI]
LF5  WS2812B-MINI  [WS2812B-MINI]
LF6  WS2812B-MINI  [WS2812B-MINI]
LF7  WS2812B-MINI  [WS2812B-MINI]
LF8  WS2812B-MINI  [WS2812B-MINI]
LF9  WS2812B-MINI  [WS2812B-MINI]
LF10  WS2812B-MINI  [WS2812B-MINI]
LF11  WS2812B-MINI  [WS2812B-MINI]
LF12  WS2812B-MINI  [WS2812B-MINI]
LG  WS2812B-MINI  [WS2812B-MINI]
LGRAVE  WS2812B-MINI  [WS2812B-MINI]
LH  WS2812B-MINI  [WS2812B-MINI]
LHOME  WS2812B-MINI  [WS2812B-MINI]
LI  WS2812B-MINI  [WS2812B-MINI]
LINSERT  WS2812B-MINI  [WS2812B-MINI]
LJ  WS2812B-MINI  [WS2812B-MINI]
LK  WS2812B-MINI  [WS2812B-MINI]
LKP_0  WS2812B-MINI  [WS2812B-MINI]
LKP_1  WS2812B-MINI  [WS2812B-MINI]
LKP_2  WS2812B-MINI  [WS2812B-MINI]
LKP_3  WS2812B-MINI  [WS2812B-MINI]
LKP_4  WS2812B-MINI  [WS2812B-MINI]
LKP_5  WS2812B-MINI  [WS2812B-MINI]
LKP_6  WS2812B-MINI  [WS2812B-MINI]
LKP_7  WS2812B-MINI  [WS2812B-MINI]
LKP_8  WS2812B-MINI  [WS2812B-MINI]
LKP_9  WS2812B-MINI  [WS2812B-MINI]
LKP_52  WS2812B-MINI  [WS2812B-MINI]
LKP_62  WS2812B-MINI  [WS2812B-MINI]
LKP_ASTERISK  WS2812B-MINI  [WS2812B-MINI]
LKP_DASH  WS2812B-MINI  [WS2812B-MINI]
LKP_DEL  WS2812B-MINI  [WS2812B-MINI]
LKP_SLASH  WS2812B-MINI  [WS2812B-MINI]
LL  WS2812B-MINI  [WS2812B-MINI]
LLAST  WS2812B-MINI  [WS2812B-MINI]
LLBRACKET  WS2812B-MINI  [WS2812B-MINI]
LLEFT  WS2812B-MINI  [WS2812B-MINI]
LLOCK  WS2812B-MINI  [WS2812B-MINI]
LM  WS2812B-MINI  [WS2812B-MINI]
LM1  WS2812B-MINI  [WS2812B-MINI]
LM2  WS2812B-MINI  [WS2812B-MINI]
LM3  WS2812B-MINI  [WS2812B-MINI]
LM4  WS2812B-MINI  [WS2812B-MINI]
LM5  WS2812B-MINI  [WS2812B-MINI]
LM6  WS2812B-MINI  [WS2812B-MINI]
LMENU  WS2812B-MINI  [WS2812B-MINI]
LN  WS2812B-MINI  [WS2812B-MINI]
LNEXTSONG  WS2812B-MINI  [WS2812B-MINI]
LNUMLOCK  WS2812B-MINI  [WS2812B-MINI]
LO  WS2812B-MINI  [WS2812B-MINI]
LP  WS2812B-MINI  [WS2812B-MINI]
LPAUSE  WS2812B-MINI  [WS2812B-MINI]
LPERIOD  WS2812B-MINI  [WS2812B-MINI]
LPGDN  WS2812B-MINI  [WS2812B-MINI]
LPGUP  WS2812B-MINI  [WS2812B-MINI]
LPLAY  WS2812B-MINI  [WS2812B-MINI]
LPRTSC  WS2812B-MINI  [WS2812B-MINI]
LQ  WS2812B-MINI  [WS2812B-MINI]
LQUOTE  WS2812B-MINI  [WS2812B-MINI]
LR  WS2812B-MINI  [WS2812B-MINI]
LRAND  WS2812B-MINI  [WS2812B-MINI]
LRBRACKET  WS2812B-MINI  [WS2812B-MINI]
LRIGHT  WS2812B-MINI  [WS2812B-MINI]
LS  WS2812B-MINI  [WS2812B-MINI]
LSCROLLLOCK  WS2812B-MINI  [WS2812B-MINI]
LSEMICOLON  WS2812B-MINI  [WS2812B-MINI]
LSHIFT  WS2812B-MINI  [WS2812B-MINI]
LSHIFT2  WS2812B-MINI  [WS2812B-MINI]
LSLASH  WS2812B-MINI  [WS2812B-MINI]
LSPACE  WS2812B-MINI  [WS2812B-MINI]
LT  WS2812B-MINI  [WS2812B-MINI]
LTAB  WS2812B-MINI  [WS2812B-MINI]
LU  WS2812B-MINI  [WS2812B-MINI]
LUNDERSCORE  WS2812B-MINI  [WS2812B-MINI]
LUP  WS2812B-MINI  [WS2812B-MINI]
LV  WS2812B-MINI  [WS2812B-MINI]
LVD  WS2812B-MINI  [WS2812B-MINI]
LVU  WS2812B-MINI  [WS2812B-MINI]
LW  WS2812B-MINI  [WS2812B-MINI]
LWIN  WS2812B-MINI  [WS2812B-MINI]
LWIN2  WS2812B-MINI  [WS2812B-MINI]
LX  WS2812B-MINI  [WS2812B-MINI]
LY  WS2812B-MINI  [WS2812B-MINI]
LZ  WS2812B-MINI  [WS2812B-MINI]

### Nets
+5V: L0.VDD L1.VDD L2.VDD L3.VDD L4.VDD L5.VDD L6.VDD L7.VDD L8.VDD L9.VDD LA.VDD LALT2.VDD LALT.VDD LB.VDD LBACK.VDD LBACKSLASH.VDD LBACKSPACE.VDD LC.VDD LCAPSLOCK.VDD LCOMMA.VDD LCTRL2.VDD LCTRL.VDD LD.VDD LDASH.VDD LDEL.VDD LDELETE.VDD LDOWN.VDD LE.VDD LEND.VDD LENTER2.VDD LENTER.VDD LEQUAL2.VDD LEQUAL.VDD LESC.VDD LF1.VDD LF2.VDD LF3.VDD LF4.VDD LF5.VDD LF6.VDD LF7.VDD LF8.VDD LF9.VDD LF10.VDD LF11.VDD LF12.VDD LF.VDD LG.VDD LGRAVE.VDD LH.VDD LHOME.VDD LI.VDD LINSERT.VDD LJ.VDD LK.VDD LKP_0.VDD LKP_1.VDD LKP_2.VDD LKP_3.VDD LKP_4.VDD LKP_5.VDD LKP_6.VDD LKP_7.VDD LKP_8.VDD LKP_9.VDD LKP_52.VDD LKP_62.VDD LKP_ASTERISK.VDD LKP_DASH.VDD LKP_DEL.VDD LKP_SLASH.VDD LL.VDD LLAST.VDD LLBRACKET.VDD LLEFT.VDD LLOCK.VDD LM1.VDD LM2.VDD LM3.VDD LM4.VDD LM5.VDD LM6.VDD LM.VDD LMENU.VDD LN.VDD LNEXTSONG.VDD LNUMLOCK.VDD LO.VDD LP.VDD LPAUSE.VDD LPERIOD.VDD LPGDN.VDD LPGUP.VDD LPLAY.VDD LPRTSC.VDD LQ.VDD LQUOTE.VDD LR.VDD LRAND.VDD LRBRACKET.VDD LRIGHT.VDD LS.VDD LSCROLLLOCK.VDD LSEMICOLON.VDD LSHIFT2.VDD LSHIFT.VDD LSLASH.VDD LSPACE.VDD LT.VDD LTAB.VDD LU.VDD LUNDERSCORE.VDD LUP.VDD LV.VDD LVD.VDD LVU.VDD LW.VDD LWIN2.VDD LWIN.VDD LX.VDD LY.VDD LZ.VDD ; also sheet 3
GND: L0.GND L1.GND L2.GND L3.GND L4.GND L5.GND L6.GND L7.GND L8.GND L9.GND LA.GND LALT2.GND LALT.GND LB.GND LBACK.GND LBACKSLASH.GND LBACKSPACE.GND LC.GND LCAPSLOCK.GND LCOMMA.GND LCTRL2.GND LCTRL.GND LD.GND LDASH.GND LDEL.GND LDELETE.GND LDOWN.GND LE.GND LEND.GND LENTER2.GND LENTER.GND LEQUAL2.GND LEQUAL.GND LESC.GND LF1.GND LF2.GND LF3.GND LF4.GND LF5.GND LF6.GND LF7.GND LF8.GND LF9.GND LF10.GND LF11.GND LF12.GND LF.GND LG.GND LGRAVE.GND LH.GND LHOME.GND LI.GND LINSERT.GND LJ.GND LK.GND LKP_0.GND LKP_1.GND LKP_2.GND LKP_3.GND LKP_4.GND LKP_5.GND LKP_6.GND LKP_7.GND LKP_8.GND LKP_9.GND LKP_52.GND LKP_62.GND LKP_ASTERISK.GND LKP_DASH.GND LKP_DEL.GND LKP_SLASH.GND LL.GND LLAST.GND LLBRACKET.GND LLEFT.GND LLOCK.GND LM1.GND LM2.GND LM3.GND LM4.GND LM5.GND LM6.GND LM.GND LMENU.GND LN.GND LNEXTSONG.GND LNUMLOCK.GND LO.GND LP.GND LPAUSE.GND LPERIOD.GND LPGDN.GND LPGUP.GND LPLAY.GND LPRTSC.GND LQ.GND LQUOTE.GND LR.GND LRAND.GND LRBRACKET.GND LRIGHT.GND LS.GND LSCROLLLOCK.GND LSEMICOLON.GND LSHIFT2.GND LSHIFT.GND LSLASH.GND LSPACE.GND LT.GND LTAB.GND LU.GND LUNDERSCORE.GND LUP.GND LV.GND LVD.GND LVU.GND LW.GND LWIN2.GND LWIN.GND LX.GND LY.GND LZ.GND ; also sheet 3
LEDOUT: LUP.DIN ; also sheet 3
N$1: LESC.DIN LM6.DOUT
N$2: LESC.DOUT LF1.DIN
N$3: LF1.DOUT LF2.DIN
N$4: LF2.DOUT LF3.DIN
N$5: LF3.DOUT LF4.DIN
N$6: LF4.DOUT LF5.DIN
N$7: LF5.DOUT LF6.DIN
N$8: LF6.DOUT LF7.DIN
N$9: LF7.DOUT LF8.DIN
N$10: LF8.DOUT LF9.DIN
N$11: LF9.DOUT LF10.DIN
N$12: LF10.DOUT LF11.DIN
N$13: LF11.DOUT LF12.DIN
N$14: LF12.DOUT LVD.DIN
N$15: LVD.DOUT LVU.DIN
N$16: LPRTSC.DIN LVU.DOUT
N$17: LPRTSC.DOUT LSCROLLLOCK.DIN
N$18: LPAUSE.DIN LSCROLLLOCK.DOUT
N$19: LLAST.DIN LPAUSE.DOUT
N$20: LLAST.DOUT LPLAY.DIN
N$21: LNEXTSONG.DOUT LRAND.DIN
N$22: LNEXTSONG.DIN LPLAY.DOUT
N$23: LLOCK.DIN LRAND.DOUT
N$24: LGRAVE.DOUT LM5.DIN
N$25: L1.DOUT LGRAVE.DIN
N$26: L1.DIN L2.DOUT
N$27: L2.DIN L3.DOUT
N$28: L3.DIN L4.DOUT
N$29: L4.DIN L5.DOUT
N$30: L5.DIN L6.DOUT
N$31: L6.DIN L7.DOUT
N$32: L7.DIN L8.DOUT
N$33: L8.DIN L9.DOUT
N$34: L0.DOUT L9.DIN
N$35: L0.DIN LDASH.DOUT
N$36: LDASH.DIN LEQUAL.DOUT
N$37: LM4.DOUT LTAB.DIN
N$38: LBACKSPACE.DOUT LEQUAL.DIN
N$39: LCTRL.DOUT LM1.DIN
N$40: LBACKSPACE.DIN LINSERT.DOUT
N$41: LHOME.DOUT LINSERT.DIN
N$42: LHOME.DIN LPGUP.DOUT
N$43: LNUMLOCK.DOUT LPGUP.DIN
N$44: LKP_SLASH.DOUT LNUMLOCK.DIN
N$45: LKP_ASTERISK.DOUT LKP_SLASH.DIN
N$46: LKP_ASTERISK.DIN LKP_DASH.DOUT
N$47: LDEL.DOUT LKP_62.DIN
N$48: LQ.DIN LTAB.DOUT
N$49: LQ.DOUT LW.DIN
N$50: LE.DIN LW.DOUT
N$51: LE.DOUT LR.DIN
N$52: LR.DOUT LT.DIN
N$53: LT.DOUT LY.DIN
N$54: LU.DIN LY.DOUT
N$55: LI.DIN LU.DOUT
N$56: LI.DOUT LO.DIN
N$57: LO.DOUT LP.DIN
N$58: LLBRACKET.DIN LP.DOUT
N$59: LLBRACKET.DOUT LRBRACKET.DIN
N$60: LBACKSLASH.DIN LRBRACKET.DOUT
N$61: LM3.DOUT LM4.DIN
N$62: LBACKSLASH.DOUT LDELETE.DIN
N$63: LDELETE.DOUT LEND.DIN
N$64: LEND.DOUT LPGDN.DIN
N$65: LKP_7.DIN LPGDN.DOUT
N$66: LKP_7.DOUT LKP_8.DIN
N$67: LEQUAL2.DIN LKP_9.DOUT
N$68: LKP_8.DOUT LKP_9.DIN
N$69: LEQUAL2.DOUT LKP_52.DIN
N$70: LCAPSLOCK.DOUT LM3.DIN
N$71: LA.DOUT LCAPSLOCK.DIN
N$72: LA.DIN LS.DOUT
N$73: LD.DOUT LS.DIN
N$74: LD.DIN LF.DOUT
N$75: LF.DIN LG.DOUT
N$76: LG.DIN LH.DOUT
N$77: LH.DIN LJ.DOUT
N$78: LJ.DIN LK.DOUT
N$79: LK.DIN LL.DOUT
N$80: LL.DIN LSEMICOLON.DOUT
N$81: LQUOTE.DOUT LSEMICOLON.DIN
N$82: LM2.DOUT LSHIFT.DIN
N$83: LSHIFT.DOUT LZ.DIN
N$84: LCTRL.DIN LWIN.DOUT
N$85: LX.DIN LZ.DOUT
N$86: LC.DIN LX.DOUT
N$87: LENTER.DOUT LQUOTE.DIN
N$88: LENTER.DIN LKP_4.DOUT
N$89: LC.DOUT LV.DIN
N$90: LKP_4.DIN LKP_5.DOUT
N$91: LKP_5.DIN LKP_6.DOUT
N$92: LB.DIN LV.DOUT
N$93: LB.DOUT LN.DIN
N$94: LM.DIN LN.DOUT
N$95: LCOMMA.DIN LM.DOUT
N$96: LCOMMA.DOUT LPERIOD.DIN
N$97: LPERIOD.DOUT LSLASH.DIN
N$98: LALT.DOUT LWIN.DIN
N$99: LSHIFT2.DIN LSLASH.DOUT
N$100: LALT.DIN LSPACE.DOUT
N$101: LALT2.DOUT LSPACE.DIN
N$102: LKP_6.DIN LKP_62.DOUT
N$103: LKP_52.DOUT LUNDERSCORE.DIN
N$104: LKP_1.DIN LUP.DOUT
N$105: LKP_1.DOUT LKP_2.DIN
N$106: LENTER2.DIN LKP_3.DOUT
N$107: LKP_2.DOUT LKP_3.DIN
N$108: LDEL.DIN LENTER2.DOUT
N$109: LKP_DASH.DIN LUNDERSCORE.DOUT
N$111: LALT2.DIN LWIN2.DOUT
N$113: LM5.DOUT LM6.DIN
N$114: LBACK.DIN LLOCK.DOUT
N$115: LMENU.DOUT LWIN2.DIN
N$116: LCTRL2.DOUT LMENU.DIN
N$117: LCTRL2.DIN LLEFT.DOUT
N$118: LDOWN.DOUT LLEFT.DIN
N$119: LDOWN.DIN LRIGHT.DOUT
N$120: LKP_0.DOUT LRIGHT.DIN
N$121: LKP_0.DIN LKP_DEL.DOUT
N$122: LBACK.DOUT LKP_DEL.DIN
N$123: LM1.DOUT LM2.DIN
Unconnected: LSHIFT2.DOUT

## Sheet 3 of 3: MCU
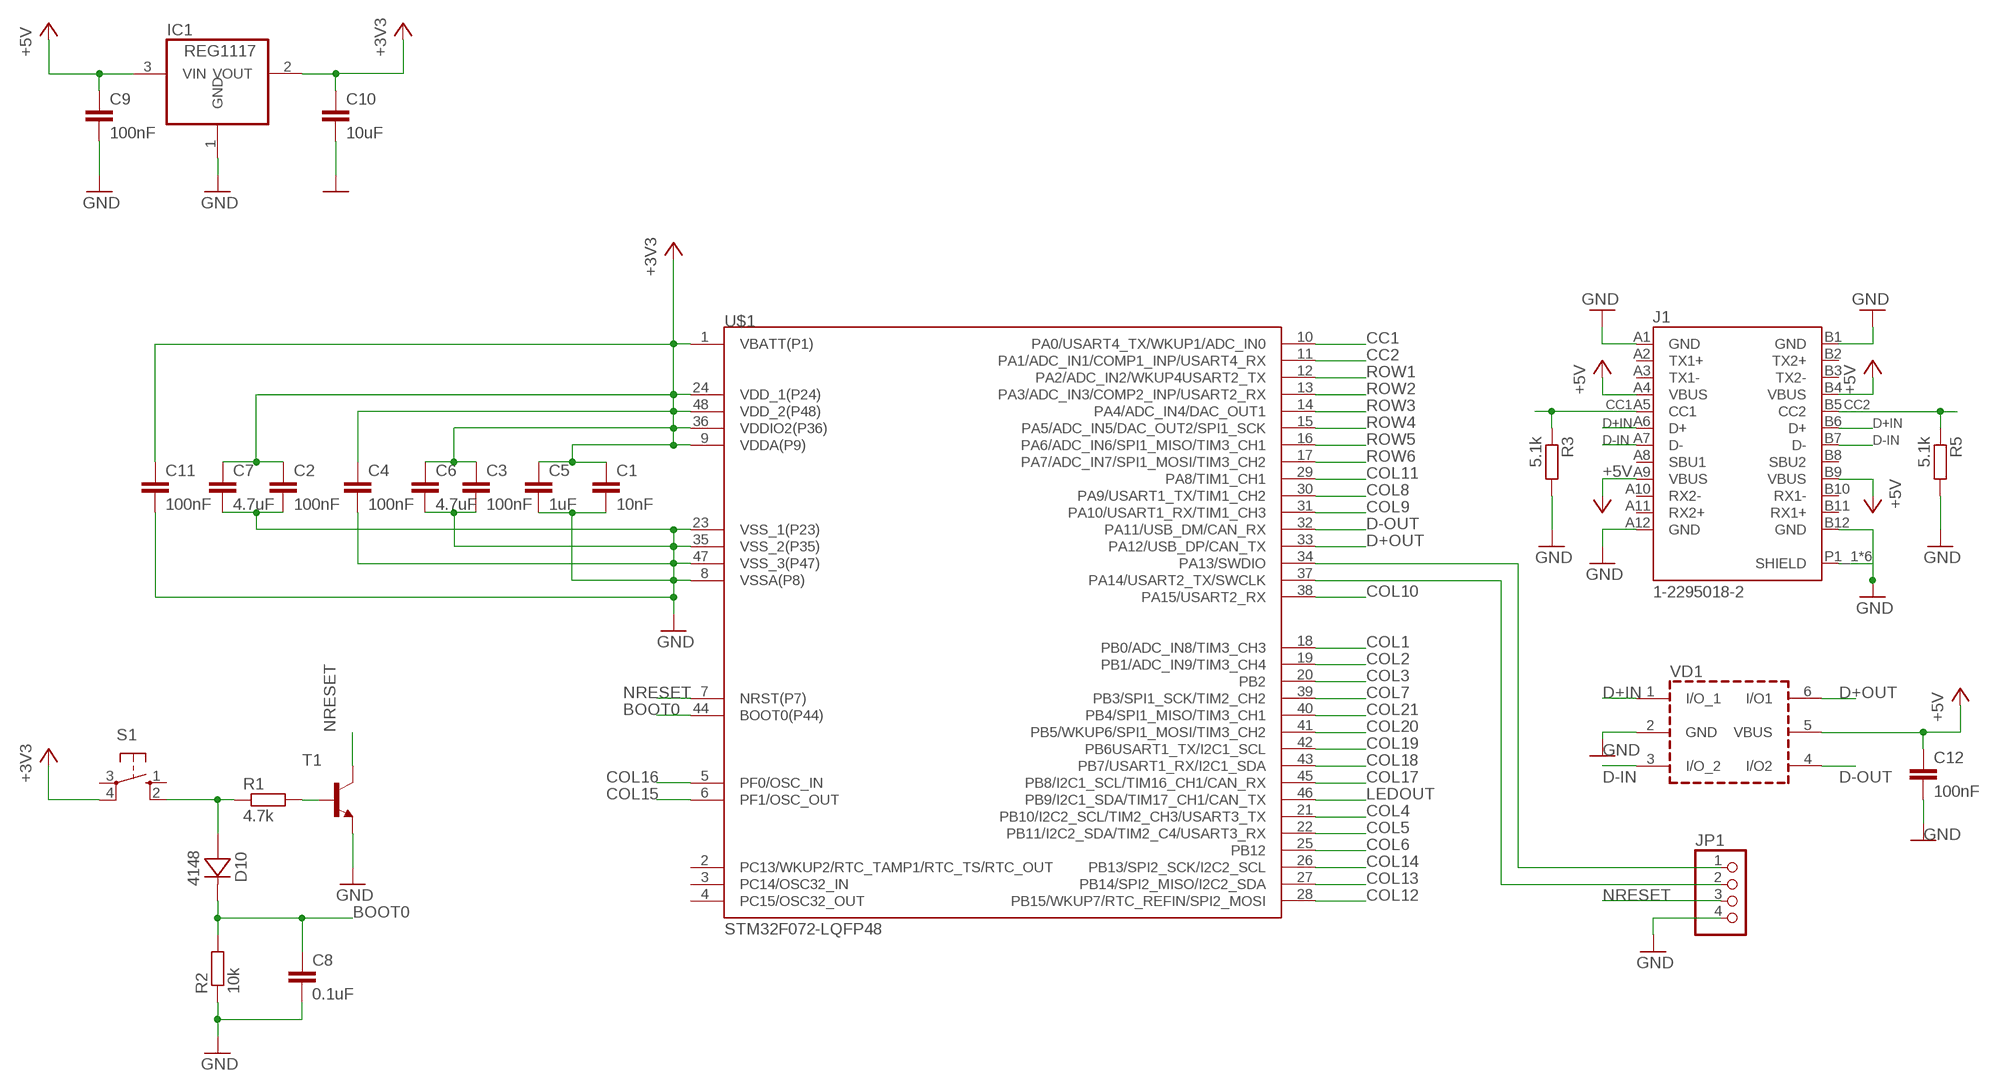
[diagram p4: schematic, sheet 3]

### Parts
C1  10nF  C-EUC0402  [C0402]
C2  100nF  C-EUC0402  [C0402]
C3  100nF  C-EUC0402  [C0402]
C4  100nF  C-EUC0402  [C0402]
C5  1uF  C-EUC0402  [C0402]
C6  4.7uF  C-EUC0402  [C0402]
C7  4.7uF  C-EUC0402  [C0402]
C8  0.1uF  C-EUC0402  [C0402]
C9  100nF  C-EUC0402  [C0402]
C10  10uF  C-EUC0402  [C0402]
C11  100nF  C-EUC0402  [C0402]
C12  100nF  C-EUC0805  [C0805]
D10  4148  DIODE-SOD-123  [SOD-123]
IC1  REG1117  [SOT223]
J1  1-2295018-2  [TE_1-2295018-2]
JP1  PINHD-1X4  [1X04]
R1  4.7k  R-EU_R0603  [R0603]
R2  10k  R-EU_R0603  [R0603]
R3  5.1k  R-EU_R0603  [R0603]
R5  5.1k  R-EU_R0603  [R0603]
S1  10-XX  [B3F-10XX]
T1  -NPN-SOT23-EBC  [SOT23-EBC]
U$1  STM32F072-LQFP48  [LQFP48]
VD1  USBLC6-2SC6  [SOT-23-6L]

### Nets
+3V3: C1.1 C2.1 C3.1 C4.1 C5.1 C6.1 C7.1 C10.1 C11.1 IC1.2(VOUT) S1.4(P1) U$1.1(VBATT(P1)) U$1.9(VDDA(P9)) U$1.24(VDD_1(P24)) U$1.36(VDDIO2(P36)) U$1.48(VDD_2(P48))
+5V: C9.1 C12.1 IC1.3(VIN) J1.A4(VBUS) J1.A9(VBUS) J1.B4(VBUS) J1.B9(VBUS) VD1.5(VBUS) ; also sheet 2
BOOT0: C8.1 D10.C R2.2 U$1.44(BOOT0(P44))
CC1: J1.A5(CC1) R3.1 U$1.10(PA0/USART4_TX/WKUP1/ADC_IN0)
CC2: J1.B5(CC2) R5.1 U$1.11(PA1/ADC_IN1/COMP1_INP/USART4_RX)
COL1: U$1.18(PB0/ADC_IN8/TIM3_CH3) ; also sheet 1
COL2: U$1.19(PB1/ADC_IN9/TIM3_CH4) ; also sheet 1
COL3: U$1.20(PB2) ; also sheet 1
COL4: U$1.21(PB10/I2C2_SCL/TIM2_CH3/USART3_TX) ; also sheet 1
COL5: U$1.22(PB11/I2C2_SDA/TIM2_C4/USART3_RX) ; also sheet 1
COL6: U$1.25(PB12) ; also sheet 1
COL7: U$1.39(PB3/SPI1_SCK/TIM2_CH2) ; also sheet 1
COL8: U$1.30(PA9/USART1_TX/TIM1_CH2) ; also sheet 1
COL9: U$1.31(PA10/USART1_RX/TIM1_CH3) ; also sheet 1
COL10: U$1.38(PA15/USART2_RX) ; also sheet 1
COL11: U$1.29(PA8/TIM1_CH1) ; also sheet 1
COL12: U$1.28(PB15/WKUP7/RTC_REFIN/SPI2_MOSI) ; also sheet 1
COL13: U$1.27(PB14/SPI2_MISO/I2C2_SDA) ; also sheet 1
COL14: U$1.26(PB13/SPI2_SCK/I2C2_SCL) ; also sheet 1
COL15: U$1.6(PF1/OSC_OUT) ; also sheet 1
COL16: U$1.5(PF0/OSC_IN) ; also sheet 1
COL17: U$1.45(PB8/I2C1_SCL/TIM16_CH1/CAN_RX) ; also sheet 1
COL18: U$1.43(PB7/USART1_RX/I2C1_SDA) ; also sheet 1
COL19: U$1.42(PB6USART1_TX/I2C1_SCL) ; also sheet 1
COL20: U$1.41(PB5/WKUP6/SPI1_MOSI/TIM3_CH2) ; also sheet 1
COL21: U$1.40(PB4/SPI1_MISO/TIM3_CH1) ; also sheet 1
D+IN: J1.A6(D+) J1.B6(D+) VD1.1(I/O_1)
D+OUT: U$1.33(PA12/USB_DP/CAN_TX) VD1.6(I/O1)
D-IN: J1.A7(D-) J1.B7(D-) VD1.3(I/O_2)
D-OUT: U$1.32(PA11/USB_DM/CAN_RX) VD1.4(I/O2)
GND: C1.2 C2.2 C3.2 C4.2 C5.2 C6.2 C7.2 C8.2 C9.2 C10.2 C11.2 C12.2 IC1.1(GND) J1.A1(GND) J1.A12(GND) J1.B1(GND) J1.B12(GND) J1.P1_1(SHIELD) J1.P1_2(SHIELD) J1.P2_1(SHIELD) J1.P2_2(SHIELD) J1.P4(SHIELD) J1.P5(SHIELD) JP1.4 R2.1 R3.2 R5.2 T1.E U$1.8(VSSA(P8)) U$1.23(VSS_1(P23)) U$1.35(VSS_2(P35)) U$1.47(VSS_3(P47)) VD1.2(GND) ; also sheet 2
LEDOUT: U$1.46(PB9/I2C1_SDA/TIM17_CH1/CAN_TX) ; also sheet 2
N$110: JP1.1 U$1.34(PA13/SWDIO)
N$112: JP1.2 U$1.37(PA14/USART2_TX/SWCLK)
N$144: D10.A R1.1 S1.2(S1)
N$145: R1.2 T1.B
NRESET: JP1.3 T1.C U$1.7(NRST(P7))
ROW1: U$1.12(PA2/ADC_IN2/WKUP4USART2_TX) ; also sheet 1
ROW2: U$1.13(PA3/ADC_IN3/COMP2_INP/USART2_RX) ; also sheet 1
ROW3: U$1.14(PA4/ADC_IN4/DAC_OUT1) ; also sheet 1
ROW4: U$1.15(PA5/ADC_IN5/DAC_OUT2/SPI1_SCK) ; also sheet 1
ROW5: U$1.16(PA6/ADC_IN6/SPI1_MISO/TIM3_CH1) ; also sheet 1
ROW6: U$1.17(PA7/ADC_IN7/SPI1_MOSI/TIM3_CH2) ; also sheet 1
Unconnected: J1.A2(TX1+) J1.A3(TX1-) J1.A8(SBU1) J1.A10(RX2-) J1.A11(RX2+) J1.B2(TX2+) J1.B3(TX2-) J1.B8(SBU2) J1.B10(RX1-) J1.B11(RX1+) S1.1(S) S1.3(P) U$1.2(PC13/WKUP2/RTC_TAMP1/RTC_TS/RTC_OUT) U$1.3(PC14/OSC32_IN) U$1.4(PC15/OSC32_OUT)

## Library data of the parts
0 1-9 A ALT ALT2 B BACK BACKSLASH BACKSPACE C CAPSLOCK COMMA CTRL CTRL2 D DASH DEL DELETE DOWN E END ENTER ENTER2 EQUAL EQUAL2 ESC F F1-F12 G GRAVE H HOME I INSERT J K KP_0 KP_1-KP_9 KP_52 KP_62 KP_ASTERISK KP_DASH KP_DEL KP_SLASH L LAST LBRACKET LEFT LOCK M M1-M6 MENU N NEXTSONG NUMLOCK O P PAUSE PERIOD PGDN PGUP PLAY PRTSC Q QUOTE R RAND RBRACKET RIGHT S SCROLLLOCK SEMICOLON SHIFT SHIFT2 SLASH SPACE T TAB U UNDERSCORE UP V VD VU W WIN WIN2 X Y Z = Keyboard:KEYSWITCH-PLAIN
C1-C12 = rcl:C-EU: CAPACITOR, European symbol; SPICEPREFIX: C
D0 D1-D10 DA DALT DALT2 DB DBACK DBACKSLASH DBACKSPACE DC DCAPSLOCK DCOMMA DCTRL DCTRL2 DD DDASH DDEL DDELETE DDOWN DE DEND DENTER DENTER2 DEQUAL DEQUAL2 DESC DF DF1-DF12 DG DGRAVE DH DHOME DI DINSERT DJ DK DKP_0 DKP_1-DKP_9 DKP_52 DKP_62 DKP_ASTERISK DKP_DASH DKP_DEL DKP_SLASH DL DLAST DLBRACKET DLEFT DLOCK DM DM1-DM6 DMENU DN DNEXTSONG DNUMLOCK DO DP DPAUSE DPERIOD DPGDN DPGUP DPLAY DPRTSC DQ DQUOTE DR DRAND DRBRACKET DRIGHT DS DSCROLLLOCK DSEMICOLON DSHIFT DSHIFT2 DSLASH DSPACE DT DTAB DU DUNDERSCORE DUP DV DVD DVU DW DWIN DWIN2 DX DY DZ = Components:DIODE: Standard 1N4148 diode
IC1 = burr-brown:REG1117: 800mA and 1A Low Dropout (LDO) Positive Regulator 1.8V, 2.5V, 2.85V, 3.3V, 5V, and Adj; MPN: REG1117; OC_FARNELL: 1097566; OC_NEWARK: 14P6981
J1 = 1-2295018-2:1-2295018-2: SPLASH PROOF USB TYPE C REC, DUAL SMT; Tape/Reel of 900; AVAILABILITY: Unavailable; COMMENT: 1-2295018-2; DESCRIPTION: USB TYPE C, REC OFFSET 0.65MM DUAL SMT; MF: TE Connectivity; MP: 1-2295018-2; PACKAGE: None; PRICE: None; TE_PURCHASE_URL: https://www.te.com/usa-en/product-1-2295018-2.html?te_bu=Cor&te_type=disp&te_campaign=seda_glo_cor-seda-global-disp-prtnr-fy19-seda-model-bom-cta_sma-317_1&elqCampaignId=32493
JP1 = pinhead:PINHD-1X4: PIN HEADER
L0 L1-L9 LA LALT LALT2 LB LBACK LBACKSLASH LBACKSPACE LC LCAPSLOCK LCOMMA LCTRL LCTRL2 LD LDASH LDEL LDELETE LDOWN LE LEND LENTER LENTER2 LEQUAL LEQUAL2 LESC LF LF1-LF12 LG LGRAVE LH LHOME LI LINSERT LJ LK LKP_0 LKP_1-LKP_9 LKP_52 LKP_62 LKP_ASTERISK LKP_DASH LKP_DEL LKP_SLASH LL LLAST LLBRACKET LLEFT LLOCK LM LM1-LM6 LMENU LN LNEXTSONG LNUMLOCK LO LP LPAUSE LPERIOD LPGDN LPGUP LPLAY LPRTSC LQ LQUOTE LR LRAND LRBRACKET LRIGHT LS LSCROLLLOCK LSEMICOLON LSHIFT LSHIFT2 LSLASH LSPACE LT LTAB LU LUNDERSCORE LUP LV LVD LVU LW LWIN LWIN2 LX LY LZ = LED:WS2812B
R1-R3 R5 = rcl:R-EU_: RESISTOR, European symbol; SPICEPREFIX: R
S1 = switch-omron:10-XX: OMRON SWITCH; MPN: B3F-1000; OC_FARNELL: 176432; OC_NEWARK: 36M3542
T1 = transistor:*-NPN-: NPN Transistror BF959 corrected 2008.03.06
U$1 = stm32f0:STM32F072
VD1 = usblc6:USBLC6-2: VERY LOW CAPACITANCE ESD PROTECTION 2 line Datasheet link <http://www.st.com/web/catalog/sense_power/FM114/CL1137/SC1489/PF93353>

## Net classes
1 POWER: width 0.406 mm